# Altium project B202AA-PCIe.PrjPcb (part 2 of 2)

## Sheet AL1 Signal Isolation.SchDoc: AL1 Signal Isolation
size 292 x 193 mm; SheetNumber: 7; SheetTotal: 12
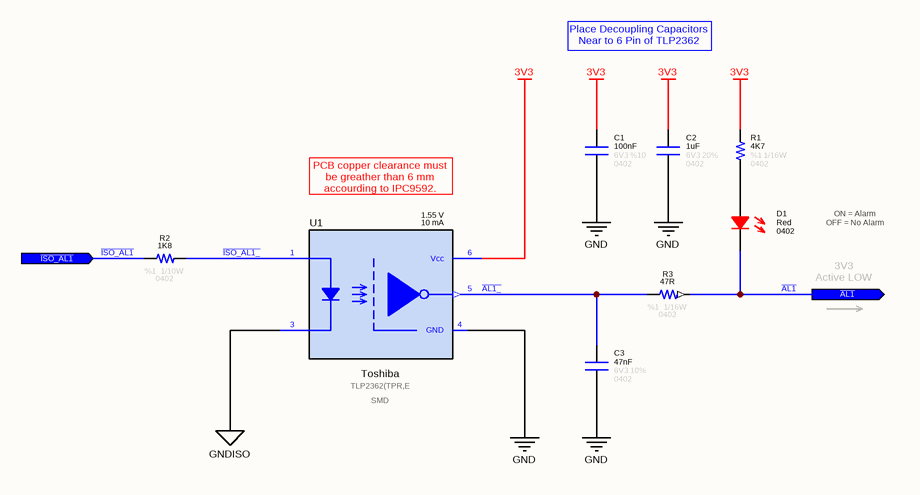
[diagram p9: AL1 Signal Isolation.SchDoc]

### Parts
C1  value 100nF  Tolerance: %10  Voltage: 6V3  Case: 0402  [CAPACITOR_0402]  (hidden comment: Capacitor - 100nF [0402] (Ceramic))
C2  value 1uF  Tolerance: 20%  Case: 0402  Voltage: 6V3  [CAPACITOR_0402]  (hidden comment: Capacitor - 1uF [0402] (MLCC))
C3  value 47nF  Tolerance: 10%  Case: 0402  Voltage: 6V3  [CAPACITOR_0402]  (hidden comment: Capacitor - 47nF [0402] (MLCC))
D1  Case: 0402  Color: Red  [LED_0402]  (hidden comment: SMD LED (Red))
R1  value 4K7  Tolerance: %1  Case: 0402  Power: 1/16W  [RESISTOR_0402]  (hidden comment: 4K7 - 0402 - %1 - 1/16W)
R2  value 1K8  Tolerance: %1  Case: 0402  Power: 1/10W  [RESISTOR_0402]  (hidden comment: 1K8 - 0402 - %1 - 1/16W)
R3  value 47R  Case: 0402  Tolerance: %1  Power: 1/16W  [RESISTOR_0402]  (hidden comment: 47R - 0402 - %1 - 1/16W)
U1  If - Forward Current: 10 mA  Vf - Forward Voltage: 1.55 V  Manufacturer Name: Toshiba  Case: SMD  [TLP2362]  (hidden comment: TLP2362(TPR,E)

### Ports
~{AL1} (out), ~{ISO_AL1} (in)

### Nets
3V3: C1.2 C2.2 R1.2 U1.6(Vcc)
GND: C1.1 C2.1 C3.1 U1.4(GND)
GNDISO: U1.3(Cathode)
~{AL1}: D1.1 R3.1 ; port ~{AL1}
~{AL1_}: C3.2 R3.2 U1.5(Output)
~{ISO_AL1}: R2.2 ; port ~{ISO_AL1}
~{ISO_AL1_}: R2.1 U1.1(Anode)
NetD1_2: D1.2 R1.1

### Notes on the sheet
- Place Decoupling Capacitors Near to 6 Pin of TLP2362
- PCB copper clearance must be greather than 6 mm accourding to IPC9592.
- ON = Alarm
  OFF = No Alarm
- 3V3
  Active LOW
- © 2021 All rights reserved.
  This document may not, in whole or in part, be copied, photocopied, reproduced, translated or converted to any electronic or machine readable from without prior written permission of Mehmet Günce Akkoyun.
  Engineer contact : akkoyun@me.com
- Property of
- Engineer :
- Date :
- Size :
- A4
- Time :
- Project :
- Page :
- /
- Customer :
- Product ID :
- Module ID :
- Version :
- File :
- Revision :

### Library data of the parts
C1 = Capacitor - 100nF [0402-6V3]: Capacitor - 100nF [0402-6V3] (Ceramic); Manufacturer Name: AVX; Manufacturer Part Number: 04026D104KAT4A; ComponentLink1Description: Mouser; ComponentLink1URL: https://www.mouser.com.tr/ProductDetail/AVX/04026D104KAT4A?qs=sGAEpiMZZMs0AnBnWHyRQPg4iYkCw7IMED%2F4kpqgf7w%3D; ComponentLink2Description: DataSheet; ComponentLink2URL: https://www.mouser.com.tr/datasheet/2/40/cx5r-776519.pdf
C2 = Capacitor - 1uF [0402-6V3]: Capacitor (MLCC) - 1uF / 6V3 / 0402; Manufacturer Part Number: GRM153R60J105ME95D; Manufacturer Name: Murata Electronics; ComponentLink1Description: DataSheet; ComponentLink1URL: https://www.mouser.com.tr/datasheet/2/281/murata_03052018_GRM_Series_1-1310166.pdf; ComponentLink2Description: Mouser; ComponentLink2URL: https://www.mouser.com.tr/ProductDetail/Murata-Electronics/GRM153R60J105ME95D?qs=eeBpzGFlv%252B8jOnvCVAGQrQ%3D%3D; Subcategory: Capacitors
C3 = Capacitor - 47nF [0402-6V3]: Capacitor (MLCC) - 47nF / 6V3 / 0402; Manufacturer Name: KYOCERA AVX; Manufacturer Part Number: 04026D473KAT2A; Subcategory: Capacitors
D1 = Diode - LED (0402-Red): Standard LEDs - SMD MINI-MOLD ULTRA COMPACT RED; Manufacturer Name: ROHM Semiconductor; Manufacturer Part Number: SML-P12VTT86R; ROHS: Yes; ComponentLink1Description: DataSheet; ComponentLink1URL: https://www.mouser.com.tr/datasheet/2/348/sml-p1-e-1139198.pdf; ComponentLink2Description: Mouser; ComponentLink2URL: https://www.mouser.com.tr/ProductDetail/ROHM-Semiconductor/SML-P12U2TT86R?qs=sGAEpiMZZMseGfSY3csMkRIBDsfU3UCXJTULB5gem9Ta%252Bp%252BvZ709fg%3D%3D
R1 = Resistor - 4K7 [0402]: Thick Film Resistors - SMD 1/16 W 4.7 KOhm 1%; Manufacturer Name: Vishay; Manufacturer Part Number: CRCW04024K70FKED; ComponentLink1Description: DataSheet; ComponentLink1URL: https://www.mouser.com.tr/datasheet/2/427/dcrcwe3-1762152.pdf; ComponentLink2Description: Mouser; ComponentLink2URL: https://www.mouser.com.tr/ProductDetail/Vishay-Dale/CRCW04024K70FKED?qs=sGAEpiMZZMu61qfTUdNhG7nHf%2F6MTUn3HadIdDQu24Q%3D
R2 = Resistor - 1K8 [0402]: Thick Film Resistors - SMD 1/16 W 1.8 KOhm 1%; Manufacturer Name: Vishay; Manufacturer Part Number: CRCW04021K80FKED; ComponentLink1Description: DataSheet; ComponentLink1URL: https://www.mouser.com.tr/datasheet/2/427/dcrcwe3-1762152.pdf; ComponentLink2Description: Mouser; ComponentLink2URL: https://www.mouser.com.tr/ProductDetail/Vishay-Dale/CRCW04024K70FKED?qs=sGAEpiMZZMu61qfTUdNhG7nHf%2F6MTUn3HadIdDQu24Q%3D
R3 = Resistor - 47R [0402]: Thick Film Resistors - SMD 1/16 W 47 Ohm 1%; Manufacturer Name: Vishay; Manufacturer Part Number: CRCW040247R0FKED; ComponentLink1Description: DataSheet; ComponentLink1URL: https://www.mouser.com.tr/datasheet/2/427/dcrcwe3-1762152.pdf; ComponentLink2Description: Mouser; ComponentLink2URL: https://www.mouser.com.tr/ProductDetail/Vishay-Dale/CRCW0402330RFKED?qs=sGAEpiMZZMu61qfTUdNhG2DpbjADlD3GGS6SwBlLi5Q%3D
U1 = IC - TLP2362: High Speed Optocouplers 3750 Vrms 10MBd 4mA 2.7 to 5.5V LED; Manufacturer Part Number: TLP2362(TPR,E

## Sheet AL2 Signal Isolation.SchDoc: AL2 Signal Isolation
size 292 x 193 mm; SheetNumber: 8; SheetTotal: 12
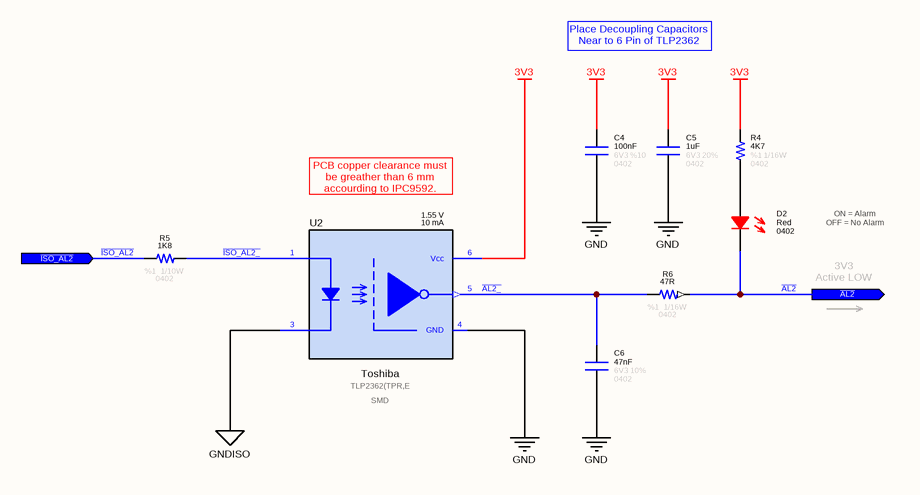
[diagram p10: AL2 Signal Isolation.SchDoc]

### Parts
C4  value 100nF  Tolerance: %10  Voltage: 6V3  Case: 0402  [CAPACITOR_0402]  (hidden comment: Capacitor - 100nF [0402] (Ceramic))
C5  value 1uF  Tolerance: 20%  Case: 0402  Voltage: 6V3  [CAPACITOR_0402]  (hidden comment: Capacitor - 1uF [0402] (MLCC))
C6  value 47nF  Tolerance: 10%  Case: 0402  Voltage: 6V3  [CAPACITOR_0402]  (hidden comment: Capacitor - 47nF [0402] (MLCC))
D2  Case: 0402  Color: Red  [LED_0402]  (hidden comment: SMD LED (Red))
R4  value 4K7  Tolerance: %1  Case: 0402  Power: 1/16W  [RESISTOR_0402]  (hidden comment: 4K7 - 0402 - %1 - 1/16W)
R5  value 1K8  Tolerance: %1  Case: 0402  Power: 1/10W  [RESISTOR_0402]  (hidden comment: 1K8 - 0402 - %1 - 1/16W)
R6  value 47R  Case: 0402  Tolerance: %1  Power: 1/16W  [RESISTOR_0402]  (hidden comment: 47R - 0402 - %1 - 1/16W)
U2  If - Forward Current: 10 mA  Vf - Forward Voltage: 1.55 V  Manufacturer Name: Toshiba  Case: SMD  [TLP2362]  (hidden comment: TLP2362(TPR,E)

### Ports
~{AL2} (out), ~{ISO_AL2} (in)

### Nets
3V3: C4.2 C5.2 R4.2 U2.6(Vcc)
GND: C4.1 C5.1 C6.1 U2.4(GND)
GNDISO: U2.3(Cathode)
~{AL2}: D2.1 R6.1 ; port ~{AL2}
~{AL2_}: C6.2 R6.2 U2.5(Output)
~{ISO_AL2}: R5.2 ; port ~{ISO_AL2}
~{ISO_AL2_}: R5.1 U2.1(Anode)
NetD2_2: D2.2 R4.1

### Notes on the sheet
- Place Decoupling Capacitors Near to 6 Pin of TLP2362
- PCB copper clearance must be greather than 6 mm accourding to IPC9592.
- ON = Alarm
  OFF = No Alarm
- 3V3
  Active LOW
- © 2021 All rights reserved.
  This document may not, in whole or in part, be copied, photocopied, reproduced, translated or converted to any electronic or machine readable from without prior written permission of Mehmet Günce Akkoyun.
  Engineer contact : akkoyun@me.com
- Property of
- Engineer :
- Date :
- Size :
- A4
- Time :
- Project :
- Page :
- /
- Customer :
- Product ID :
- Module ID :
- Version :
- File :
- Revision :

### Library data of the parts
C4 = Capacitor - 100nF [0402-6V3]: as C1 on sheet AL1 Signal Isolation; ComponentLink1Description: Mouser; ComponentLink1URL: https://www.mouser.com.tr/ProductDetail/AVX/04026D104KAT4A?qs=sGAEpiMZZMs0AnBnWHyRQPg4iYkCw7IMED%2F4kpqgf7w%3D; ComponentLink2Description: DataSheet; ComponentLink2URL: https://www.mouser.com.tr/datasheet/2/40/cx5r-776519.pdf
C5 = Capacitor - 1uF [0402-6V3]: as C2 on sheet AL1 Signal Isolation; ComponentLink1Description: DataSheet; ComponentLink1URL: https://www.mouser.com.tr/datasheet/2/281/murata_03052018_GRM_Series_1-1310166.pdf; ComponentLink2Description: Mouser; ComponentLink2URL: https://www.mouser.com.tr/ProductDetail/Murata-Electronics/GRM153R60J105ME95D?qs=eeBpzGFlv%252B8jOnvCVAGQrQ%3D%3D; Subcategory: Capacitors
C6 = Capacitor - 47nF [0402-6V3]: as C3 on sheet AL1 Signal Isolation; Subcategory: Capacitors
D2 = Diode - LED (0402-Red): as D1 on sheet AL1 Signal Isolation; ROHS: Yes; ComponentLink1Description: DataSheet; ComponentLink1URL: https://www.mouser.com.tr/datasheet/2/348/sml-p1-e-1139198.pdf; ComponentLink2Description: Mouser; ComponentLink2URL: https://www.mouser.com.tr/ProductDetail/ROHM-Semiconductor/SML-P12U2TT86R?qs=sGAEpiMZZMseGfSY3csMkRIBDsfU3UCXJTULB5gem9Ta%252Bp%252BvZ709fg%3D%3D
R4 = Resistor - 4K7 [0402]: as R1 on sheet AL1 Signal Isolation; ComponentLink1Description: DataSheet; ComponentLink1URL: https://www.mouser.com.tr/datasheet/2/427/dcrcwe3-1762152.pdf; ComponentLink2Description: Mouser; ComponentLink2URL: https://www.mouser.com.tr/ProductDetail/Vishay-Dale/CRCW04024K70FKED?qs=sGAEpiMZZMu61qfTUdNhG7nHf%2F6MTUn3HadIdDQu24Q%3D
R5 = Resistor - 1K8 [0402]: as R2 on sheet AL1 Signal Isolation; ComponentLink1Description: DataSheet; ComponentLink1URL: https://www.mouser.com.tr/datasheet/2/427/dcrcwe3-1762152.pdf; ComponentLink2Description: Mouser; ComponentLink2URL: https://www.mouser.com.tr/ProductDetail/Vishay-Dale/CRCW04024K70FKED?qs=sGAEpiMZZMu61qfTUdNhG7nHf%2F6MTUn3HadIdDQu24Q%3D
R6 = Resistor - 47R [0402]: as R3 on sheet AL1 Signal Isolation; ComponentLink1Description: DataSheet; ComponentLink1URL: https://www.mouser.com.tr/datasheet/2/427/dcrcwe3-1762152.pdf; ComponentLink2Description: Mouser; ComponentLink2URL: https://www.mouser.com.tr/ProductDetail/Vishay-Dale/CRCW0402330RFKED?qs=sGAEpiMZZMu61qfTUdNhG2DpbjADlD3GGS6SwBlLi5Q%3D
U2 = IC - TLP2362: as U1 on sheet AL1 Signal Isolation; Manufacturer Part Number: TLP2362(TPR,E

## Sheet UART Comm Isolation.SchDoc: UART Isolation
size 292 x 193 mm; SheetNumber: 6; SheetTotal: 12
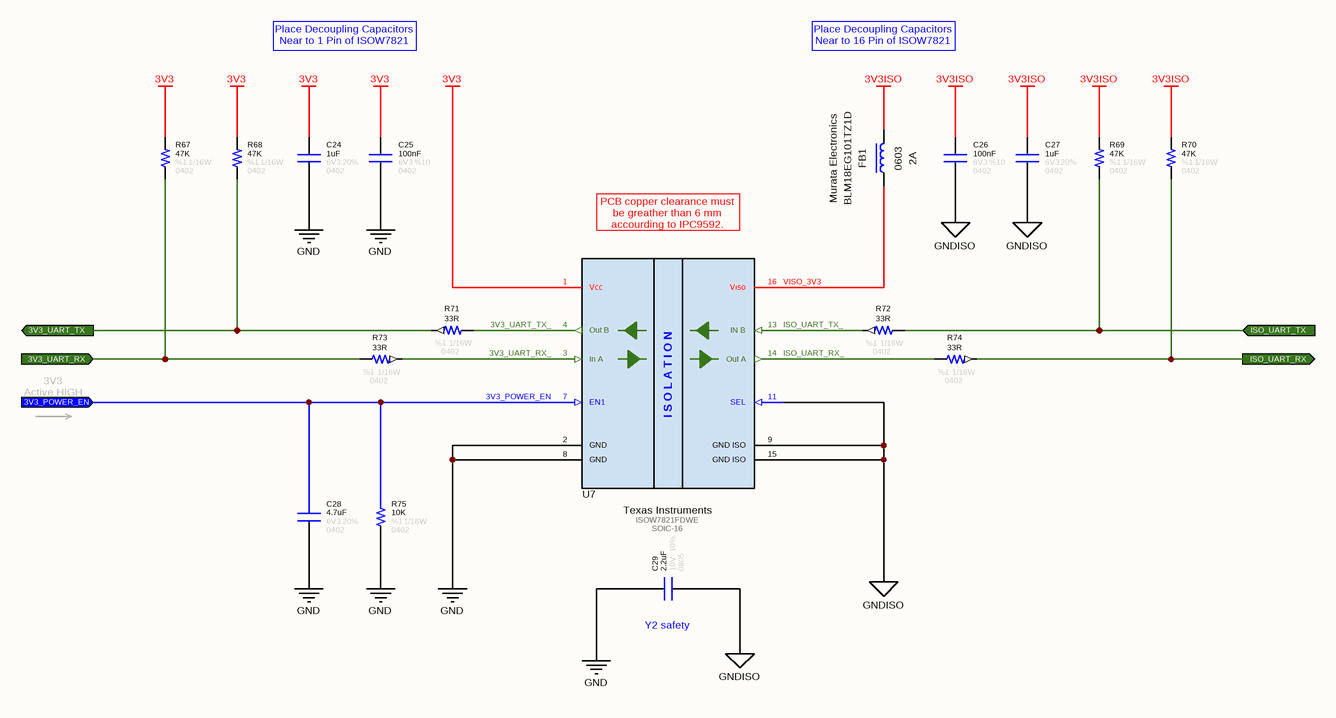
[diagram p11: UART Comm Isolation.SchDoc]

### Parts
C24  value 1uF  Tolerance: 20%  Case: 0402  Voltage: 6V3  [CAPACITOR_0402]  (hidden comment: Capacitor - 1uF [0402] (MLCC))
C25  value 100nF  Tolerance: %10  Voltage: 6V3  Case: 0402  [CAPACITOR_0402]  (hidden comment: Capacitor - 100nF [0402] (Ceramic))
C26  value 100nF  Tolerance: %10  Voltage: 6V3  Case: 0402  [CAPACITOR_0402]  (hidden comment: Capacitor - 100nF [0402] (Ceramic))
C27  value 1uF  Tolerance: 20%  Case: 0402  Voltage: 6V3  [CAPACITOR_0402]  (hidden comment: Capacitor - 1uF [0402] (MLCC))
C28  value 4.7uF  Tolerance: 20%  Case: 0402  Voltage: 6V3  [CAPACITOR_0402]  (hidden comment: Capacitor - 4.7uF [0402] (Ceramic))
C29  value 2.2uF  Tolerance: 10%  Case: 0805  Voltage: 10V  [CAPACITOR_0805]  (hidden comment: Capacitor - 2.2uF [0805] (MLCC))
FB1  Maximum DC Current: 2A  Case: 0603  Manufacturer Part Number: BLM18EG101TZ1D  Manufacturer Name: Murata Electronics  [INDUCTOR_0603]  (hidden comment: Ferrite Bead)
R67  value 47K  Tolerance: %1  Case: 0402  Power: 1/16W  [RESISTOR_0402]  (hidden comment: 47K - 0402 - %1 - 1/16W)
R68  value 47K  Tolerance: %1  Case: 0402  Power: 1/16W  [RESISTOR_0402]  (hidden comment: 47K - 0402 - %1 - 1/16W)
R69  value 47K  Tolerance: %1  Case: 0402  Power: 1/16W  [RESISTOR_0402]  (hidden comment: 47K - 0402 - %1 - 1/16W)
R70  value 47K  Tolerance: %1  Case: 0402  Power: 1/16W  [RESISTOR_0402]  (hidden comment: 47K - 0402 - %1 - 1/16W)
R71  value 33R  Case: 0402  Tolerance: %1  Power: 1/16W  [RESISTOR_0402]  (hidden comment: 33R - 0402 - %1 - 1/16W)
R72  value 33R  Case: 0402  Tolerance: %1  Power: 1/16W  [RESISTOR_0402]  (hidden comment: 33R - 0402 - %1 - 1/16W)
R73  value 33R  Case: 0402  Tolerance: %1  Power: 1/16W  [RESISTOR_0402]  (hidden comment: 33R - 0402 - %1 - 1/16W)
R74  value 33R  Case: 0402  Tolerance: %1  Power: 1/16W  [RESISTOR_0402]  (hidden comment: 33R - 0402 - %1 - 1/16W)
R75  value 10K  Tolerance: %1  Case: 0402  Power: 1/16W  [RESISTOR_0402]  (hidden comment: 10K - 0402 - %1 - 1/16W)
U7  Manufacturer Name: Texas Instruments  Manufacturer Part Number: ISOW7821FDWE  Case: SOIC-16  [SOIC-16 DW]  (hidden comment: ISOW7821)

### Ports
3V3_POWER_EN (in), 3V3_UART_RX (in), 3V3_UART_TX (out), ISO_UART_RX (out), ISO_UART_TX (in)

### Nets
3V3: C24.2 C25.2 R67.2 R68.2 U7.1(Vcc)
3V3ISO: C26.2 C27.2 FB1.2 R69.2 R70.2
GND: C24.1 C25.1 C28.1 C29.2 R75.1 U7.2(GND) U7.8(GND)
GNDISO: C26.1 C27.1 C29.1 U7.9(GND_ISO) U7.11(SEL) U7.15(GND_ISO)
3V3_POWER_EN: C28.2 R75.2 U7.7(EN1) ; port 3V3_POWER_EN
3V3_UART_RX: R67.1 R73.2 ; port 3V3_UART_RX
3V3_UART_RX_: R73.1 U7.3(In_A)
3V3_UART_TX: R68.1 R71.2 ; port 3V3_UART_TX
3V3_UART_TX_: R71.1 U7.4(Out_B)
ISO_UART_RX: R70.1 R74.1 ; port ISO_UART_RX
ISO_UART_RX_: R74.2 U7.14(Out_A)
ISO_UART_TX: R69.1 R72.1 ; port ISO_UART_TX
ISO_UART_TX_: R72.2 U7.13(IN_B)
VISO_3V3: FB1.1 U7.16(Viso)

Not connected (* = marked no-connect by the designer): U7 5(NC) 6(NC) 10(NC) 12(NC)

### Notes on the sheet
- Place Decoupling Capacitors Near to 1 Pin of ISOW7821
- Place Decoupling Capacitors Near to 16 Pin of ISOW7821
- PCB copper clearance must be greather than 6 mm accourding to IPC9592.
- 3V3
  Active HIGH
- (near C29) Y2 safety
- © 2021 All rights reserved.
  This document may not, in whole or in part, be copied, photocopied, reproduced, translated or converted to any electronic or machine readable from without prior written permission of Mehmet Günce Akkoyun.
  Engineer contact : akkoyun@me.com
- Property of
- Engineer :
- Date :
- Size :
- A4
- Time :
- Project :
- Page :
- /
- Customer :
- Product ID :
- Module ID :
- Version :
- File :
- Revision :
- (in symbol IC - ISOW7821) I S O L A T I O N

### Library data of the parts
C24 C27 = Capacitor - 1uF [0402-6V3]: as C2 on sheet AL1 Signal Isolation; ComponentLink1Description: DataSheet; ComponentLink1URL: https://www.mouser.com.tr/datasheet/2/281/murata_03052018_GRM_Series_1-1310166.pdf; ComponentLink2Description: Mouser; ComponentLink2URL: https://www.mouser.com.tr/ProductDetail/Murata-Electronics/GRM153R60J105ME95D?qs=eeBpzGFlv%252B8jOnvCVAGQrQ%3D%3D; Subcategory: Capacitors
C25 C26 = Capacitor - 100nF [0402-6V3]: as C1 on sheet AL1 Signal Isolation; ComponentLink1Description: Mouser; ComponentLink1URL: https://www.mouser.com.tr/ProductDetail/AVX/04026D104KAT4A?qs=sGAEpiMZZMs0AnBnWHyRQPg4iYkCw7IMED%2F4kpqgf7w%3D; ComponentLink2Description: DataSheet; ComponentLink2URL: https://www.mouser.com.tr/datasheet/2/40/cx5r-776519.pdf
C28 = Capacitor - 4.7uF [0402-6V3]: Multilayer Ceramic Capacitors - SMD - 6V3 4.7uF X5R 0402 20%; Manufacturer Part Number: C0402C475M9PACTU; Manufacturer Name: KEMET
C29 = Capacitor - 2.2uF [0805-10V]: Multilayer Ceramic Capacitors MLCC - SMD/SMT WCAP-CSGP 2.2uF 0805 10% 10V MLCC; Manufacturer Part Number: 885012207024; Manufacturer Name: Wurth Elektronik; Subcategory: Capacitors
FB1 = Inductor - Ferrite Bead [SMD]: Ferrite Beads 0603 100ohms 2000mA Auto Infotainment; Maximum DC Resistance: 45 mOhms; Tolerance: 25%; Value: BLM18EG101TZ1D; Height: 0.75mm; Maximum Operating Temperature: + 125; Minimum Operating Temperature: -55
R67-R70 = Resistor - 47K [0402]: Thick Film Resistors - SMD 1/16 W 47 KOhm 1%; Manufacturer Name: Vishay; Manufacturer Part Number: CRCW040247K0FKED; ComponentLink1Description: DataSheet; ComponentLink1URL: https://www.mouser.com.tr/datasheet/2/427/dcrcwe3-1762152.pdf; ComponentLink2Description: Mouser; ComponentLink2URL: https://www.mouser.com.tr/ProductDetail/Vishay-Dale/CRCW040247K0FKED?qs=sGAEpiMZZMu61qfTUdNhG2DpbjADlD3GL%252B3h1elTxqU%3D
R71-R74 = Resistor - 33R [0402]: Thick Film Resistors - SMD 1/16 W 33 Ohm 1%; Manufacturer Name: Vishay; Manufacturer Part Number: CRCW040233R0FKED; ComponentLink1Description: DataSheet; ComponentLink1URL: https://www.mouser.com.tr/datasheet/2/427/dcrcwe3-1762152.pdf; ComponentLink2Description: Mouser; ComponentLink2URL: https://www.mouser.com.tr/ProductDetail/Vishay-Dale/CRCW0402330RFKED?qs=sGAEpiMZZMu61qfTUdNhG2DpbjADlD3GGS6SwBlLi5Q%3D
R75 = Resistor - 10K [0402]: Thick Film Resistors - SMD 1/16 W 10 KOhm 1%; Manufacturer Name: Vishay; Manufacturer Part Number: CRCW040210K0FKED; ComponentLink1Description: DataSheet; ComponentLink1URL: https://www.mouser.com.tr/datasheet/2/427/dcrcwe3-1762152.pdf; ComponentLink2Description: Mouser; ComponentLink2URL: https://www.mouser.com.tr/ProductDetail/Vishay-Dale/CRCW040210K0FKED?qs=sGAEpiMZZMu61qfTUdNhG2DpbjADlD3GcalbOv9utCY%3D
U7 = IC - ISOW7821: Digital Isolators Dual-channel 1/1 r einforced digital is A 595-ISOW7821FDWER; Isolation Voltage: 5000 Vrms; Supply Voltage - Min: 3 V; Supply Voltage - Max: 5V5

## Nets that join several sheets
3V3: Card Edge Connecgtor (J1.7 J1.8), R Phase Sense Signal Isolation (R49.2 R50.2), S Phase Sense Signal Isolation (R55.2 R56.2), T Phase Sense Signal Isolation (R61.2 R62.2), AL1 Signal Isolation (C1.2 C2.2 R1.2 U1.6), AL2 Signal Isolation (C4.2 C5.2 R4.2 U2.6), UART Comm Isolation (5 pins)
3V3ISO: MAX78630 SOC (17 pins), UART Comm Isolation (5 pins)
GND: Card Edge Connecgtor (12 pins), R Phase Sense Signal Isolation (C21.1 U4.3), S Phase Sense Signal Isolation (C22.1 U5.3), T Phase Sense Signal Isolation (C23.1 U6.3), AL1 Signal Isolation (C1.1 C2.1 C3.1 U1.4), AL2 Signal Isolation (C4.1 C5.1 C6.1 U2.4), UART Comm Isolation (7 pins)
GNDISO: MAX78630 SOC (10 pins), Current Voltage Dividers (R9.1 R12.1 R15.1), AL1 Signal Isolation (U1.3), AL2 Signal Isolation (U2.3), UART Comm Isolation (6 pins)
NOTR: MAX78630 SOC (5 pins), Phase Voltage Dividers (9 pins), Energy Inputs (J2.4), R Phase Sense Signal Isolation (D11.2 U8.3), S Phase Sense Signal Isolation (D15.2 U9.3), T Phase Sense Signal Isolation (D19.2 U10.3)
3V3_POWER_EN: Card Edge Connecgtor (J1.12), UART Comm Isolation (C28.2 R75.2 U7.7)
3V3_UART_RX: Card Edge Connecgtor (J1.20), UART Comm Isolation (R67.1 R73.2)
3V3_UART_TX: Card Edge Connecgtor (J1.22), UART Comm Isolation (R68.1 R71.2)
~{AL1}: Card Edge Connecgtor (J1.26), AL1 Signal Isolation (D1.1 R3.1)
~{AL2}: Card Edge Connecgtor (J1.28), AL2 Signal Isolation (D2.1 R6.1)
Analog_IR: MAX78630 SOC (U3.29), Current Voltage Dividers (5 pins)
Analog_IS: MAX78630 SOC (U3.30), Current Voltage Dividers (5 pins)
Analog_IT: MAX78630 SOC (U3.31), Current Voltage Dividers (5 pins)
Analog_VR: MAX78630 SOC (U3.25), Phase Voltage Dividers (R37.1)
Analog_VS: MAX78630 SOC (U3.26), Phase Voltage Dividers (R41.1)
Analog_VT: MAX78630 SOC (U3.27), Phase Voltage Dividers (R45.1)
CT_R+: Current Voltage Dividers (R7.2), Energy Inputs (J3.1)
CT_R-: Current Voltage Dividers (5 pins), Energy Inputs (J3.2)
CT_S+: Current Voltage Dividers (R10.2), Energy Inputs (J3.3)
CT_S-: Current Voltage Dividers (5 pins), Energy Inputs (J3.4)
CT_T+: Current Voltage Dividers (R13.2), Energy Inputs (J3.5)
CT_T-: Current Voltage Dividers (5 pins), Energy Inputs (J3.6)
~{ISO_AL1}: MAX78630 SOC (R20.1 U3.20), AL1 Signal Isolation (R2.2)
~{ISO_AL2}: MAX78630 SOC (R19.1 U3.9), AL2 Signal Isolation (R5.2)
ISO_UART_RX: MAX78630 SOC (U3.17), UART Comm Isolation (R70.1 R74.1)
ISO_UART_TX: MAX78630 SOC (U3.16), UART Comm Isolation (R69.1 R72.1)
~{SENSE_VR}: Card Edge Connecgtor (J1.36), R Phase Sense Signal Isolation (C21.2 D9.1 R50.1 U4.4)
~{SENSE_VS}: Card Edge Connecgtor (J1.38), S Phase Sense Signal Isolation (C22.2 D13.1 R56.1 U5.4)
~{SENSE_VT}: Card Edge Connecgtor (J1.40), T Phase Sense Signal Isolation (C23.2 D17.1 R62.1 U6.4)
VR: Phase Voltage Dividers (R34.2), Energy Inputs (J2.7), R Phase Sense Signal Isolation (D11.1 U8.4)
VS: Phase Voltage Dividers (R38.2), Energy Inputs (J2.6), S Phase Sense Signal Isolation (D15.1 U9.4)
VT: Phase Voltage Dividers (R42.2), Energy Inputs (J2.5), T Phase Sense Signal Isolation (D19.1 U10.4)

## Assembly variants
PCB Mount: not fitted J2